# Altium project AlarmTimer_PCB.PrjPcb
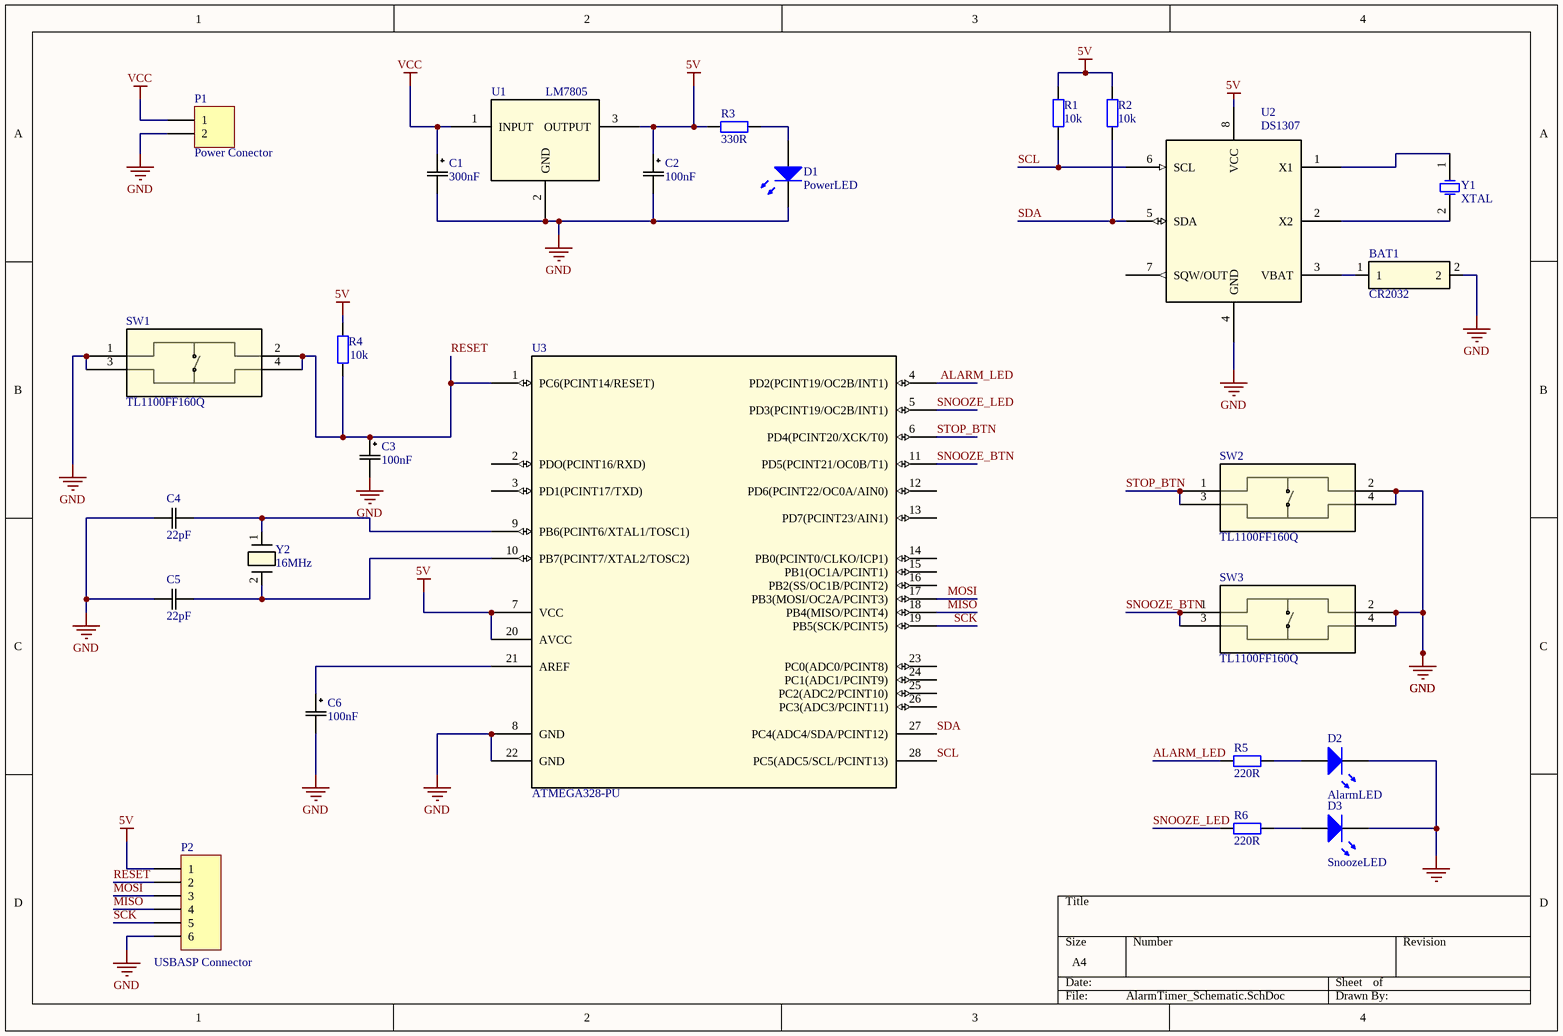
[diagram p0: AlarmTimer_Schematic.SchDoc]
1 sheet, 26 parts. Net scope: global (net labels, ports and power ports of the same name join across sheets).
Board file: AlarmTimer_Layout.PcbDoc

## Sheet AlarmTimer_Schematic.SchDoc
size A4; SheetNumber: 1; SheetTotal: 1

### Parts
BAT1  CR2032  [BAT_SMTU2032_RNB]
C1  300nF  [CAP_UEP_5X11_NCH]
C2  100nF  [CAP_UEP_5X11_NCH]
C3  100nF  [CAP_UEP_5X11_NCH]
C4  22pF  [CAP_FA28_TDK]
C5  22pF  [CAP_FA28_TDK]
C6  100nF  [CAP_UEP_5X11_NCH]
D1  PowerLED  [LED]
D2  AlarmLED  [LED]
D3  SnoozeLED  [LED]
P1  Power Conector  [HDR1X2H]
P2  USBASP Connector  [HDR1X6H]
R1  10k  [AXIAL-0.4]
R2  10k  [AXIAL-0.4]
R3  value 330R  [AXIAL-0.4]
R4  value 10k  [AXIAL-0.4]
R5  value 220R  [AXIAL-0.4]
R6  value 220R  [AXIAL-0.4]
SW1  TL1100FF160Q  [TL1100F]
SW2  TL1100FF160Q  [TL1100F]
SW3  TL1100FF160Q  [TL1100F]
U1  LM7805  [TO-220_FAS]
U2  DS1307  [21-0043D_8_MXM]
U3  ATMEGA328-PU  [28P3_SPDIP28_SP_MCH]
Y1  XTAL  [R38]
Y2  16MHz  [XTAL_ABL_ABR]

### Nets
5V: C2.1 P2.1 R1.1 R2.1 R3.1 R4.2 U1.3(OUTPUT) U2.8(VCC) U3.7(VCC) U3.20(AVCC)
GND: BAT1.2 C1.2 C2.2 C3.2 C4.1 C5.1 C6.2 D1.1 D2.1 D3.1 P1.2 P2.6 SW1.1 SW1.3 SW2.2 SW2.4 SW3.2 SW3.4 U1.2(GND) U2.4(GND) U3.8(GND) U3.22(GND)
VCC: C1.1 P1.1 U1.1(INPUT)
ALARM_LED: R5.1 U3.4(PD2(PCINT19/OC2B/INT1))
MISO: P2.4 U3.18(PB4(MISO/PCINT4))
MOSI: P2.3 U3.17(PB3(MOSI/OC2A/PCINT3))
RESET: C3.1 P2.2 R4.1 SW1.2 SW1.4 U3.1(PC6(PCINT14/RESET))
SCK: P2.5 U3.19(PB5(SCK/PCINT5))
SCL: R1.2 U2.6(SCL) U3.28(PC5(ADC5/SCL/PCINT13))
SDA: R2.2 U2.5(SDA) U3.27(PC4(ADC4/SDA/PCINT12))
SNOOZE_BTN: SW3.1 SW3.3 U3.11(PD5(PCINT21/OC0B/T1))
SNOOZE_LED: R6.1 U3.5(PD3(PCINT19/OC2B/INT1))
STOP_BTN: SW2.1 SW2.3 U3.6(PD4(PCINT20/XCK/T0))
NetBAT1_1: BAT1.1 U2.3(VBAT)
NetC4_2: C4.2 U3.9(PB6(PCINT6/XTAL1/TOSC1)) Y2.1
NetC5_2: C5.2 U3.10(PB7(PCINT7/XTAL2/TOSC2)) Y2.2
NetC6_1: C6.1 U3.21(AREF)
NetD1_2: D1.2 R3.2
NetD2_2: D2.2 R5.2
NetD3_2: D3.2 R6.2
NetU2_1: U2.1(X1) Y1.1(OSC1)
NetU2_2: U2.2(X2) Y1.2(OSC2)

Not connected (* = marked no-connect by the designer): U2 7(SQW/OUT); U3 2(PDO(PCINT16/RXD)) 3(PD1(PCINT17/TXD)) 12(PD6(PCINT22/OC0A/AIN0)) 13(PD7(PCINT23/AIN1)) 14(PB0(PCINT0/CLKO/ICP1)) 15(PB1(OC1A/PCINT1)) 16(PB2(SS/OC1B/PCINT2)) 23(PC0(ADC0/PCINT8)) 24(PC1(ADC1/PCINT9)) 25(PC2(ADC2/PCINT10)) 26(PC3(ADC3/PCINT11))

### Library data of the parts
BAT1 = SMTU2032: No Description Available; Built_By: EMA_Justin; Vendor: Renata Batteries; SourceLibrary: Add_to_database_2020-12-24; Datasheet: https://www.mouser.com/datasheet/2/346/SMTU2032-C-258020.pdf; Copyright: Copyright (C) 2018 Accelerated Designs. All rights reserved; Manufacturer_Part_Number: SMTU2032; RefDes: RefDes; Type: DEV
C1-C3 C6 = Cap Pol: No Description Available; Manufacturer_Part_Number: UFW2A0R1MDD1TD; Vendor: Nichicon; Built_By: EMA_Cory; SourceLibrary: Nichicon_2019-09-13; Type: DEV; Copyright: Copyright (C) 2018 Accelerated Designs. All rights reserved; RefDes: RefDes
C4 C5 = FA28C0G1H220JNU00: No Description Available; Built_By: EMA_Matt; Vendor: TDK; SourceLibrary: TDK_2019-10-09; Type: DEV; Copyright: Copyright (C) 2018 Accelerated Designs. All rights reserved; Manufacturer_Part_Number: FA28C0G1H220JNU00; RefDes: RefDes
D1-D3 = LED
P1 = Header 2H: Header, 2-Pin, Right Angle; LatestRevisionDate: 17-Jul-2002; LatestRevisionNote: Re-released for DXP Platform.; Publisher: Altium Limited
P2 = Header 6H: Header, 6-Pin, Right Angle; LatestRevisionDate: 17-Jul-2002; LatestRevisionNote: Re-released for DXP Platform.; Publisher: Altium Limited
R1-R6 = Res2: Resistor; Published: 8-Jun-2000; LatestRevisionDate: 17-Jul-2002; LatestRevisionNote: Re-released for DXP Platform.; PackageReference: AXIAL-0.4; Publisher: Altium Limited; PackageDescription: Axial Device, Thru-Hole; 2 Leads; 0.4 in Pin Spacing
SW1-SW3 = TL1100FF160Q: No Description Available; Vendor: E-Switch; Built_By: EMA_Cory; SourceLibrary: E-Switch_2020-03-31; Datasheet: https://sten-eswitch-13110800-production.s3.amazonaws.com/system/asset/product_line/data_sheet/143/TL1100.pdf; Manufacturer_Part_Number: TL1100FF160Q; Copyright: Copyright (C) 2018 Accelerated Designs. All rights reserved; RefDes: RefDes; Type: DEV
U1 = LM7805CT: No Description Available; SourceLibrary: Fairchild_2008-01-01_; Built_By: EMA_UL_Team; Vendor: Fairchild Semiconductor; Manufacturer_Part_Number: LM7805CT; Copyright: Copyright (C) 2018 Accelerated Designs. All rights reserved; RefDes: RefDes; Type: DEV
U2 = DS1307+: No Description Available; SourceLibrary: Maxim_2011-05-13; Built_By: EMA_UL_Team; Vendor: Maxim Integrated Products; Manufacturer_Part_Number: DS1307+; Copyright: Copyright (C) 2018 Accelerated Designs. All rights reserved; RefDes: RefDes; Type: DEV
U3 = ATMEGA328-PU: No Description Available; SourceLibrary: Update_to_database_2021-05-13; Built_By: EMA_Cory; Vendor: Microchip; Datasheet: https://ww1.microchip.com/downloads/en/DeviceDoc/ATmega48A-PA-88A-PA-168A-PA-328-P-DS-DS40002061B.pdf; Copyright: Copyright (C) 2018 Accelerated Designs. All rights reserved; Manufacturer_Part_Number: ATMEGA328-PU; RefDes: RefDes; Type: DEV
Y1 = XTAL: Crystal Oscillator; Published: 8-Jun-2000; LatestRevisionDate: 17-Jul-2002; LatestRevisionNote: Re-released for DXP Platform.; PackageReference: R38; Publisher: Altium Limited; PackageDescription: Crystal, Thru-Hole; 2 Leads; Body 3.1 x 8.2 mm (Dia.xH)
Y2 = 16MHz: No Description Available; Manufacturer_Part_Number: ABL-20.000MHZ-B2; Vendor: Abracon; Built_By: EMA_Cory; SourceLibrary: Add_to_database_2020-12-08; Datasheet: https://abracon.com/Resonators/ABL.pdf; Copyright: Copyright (C) 2018 Accelerated Designs. All rights reserved; RefDes: RefDes; Type: DEV